# Altium schematic sheet Motor_Driver.SchDoc
size A; SheetNumber: 10; SheetTotal: 11
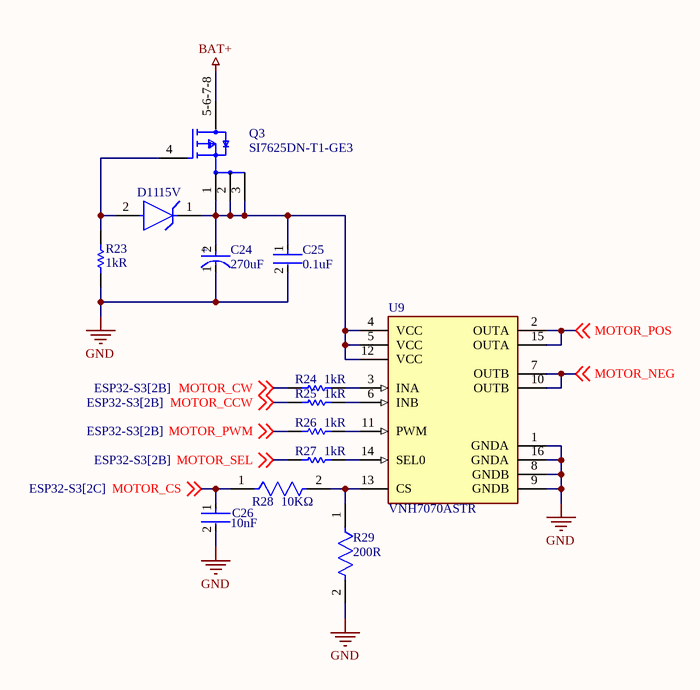
[diagram p0: Motor_Driver.SchDoc]

## Parts
C24  Capacitance: 270uF  [FP-EEH-G-V-MFG]  (hidden comment: EEHZA1V271V)
C25  Capacitance: 0.1uF  [FP-GCD21B-0_15-IPC_B]  (hidden comment: GCD21BR71H104MA01L)
C26  Capacitance: 10nF  [FP-C0805C103K8RACAUTO-MFG]  (hidden comment: C0805C103K8RACAUTO)
D11  Nom Zener Voltage: 15V  [FP-SOD123-MFG]  (hidden comment: MMSZ5245B-7-F)
Q3  SI7625DN-T1-GE3  [FP-S16-2667-SINGLE-MFG]
R23  Resistance: 1kR  [RESC2013X60X35LL10T20]  (hidden comment: AC0805JR-071KL)
R24  Resistance: 1kR  [RESC2013X60X35LL10T20]  (hidden comment: AC0805JR-071KL)
R25  Resistance: 1kR  [RESC2013X60X35LL10T20]  (hidden comment: AC0805JR-071KL)
R26  Resistance: 1kR  [RESC2013X60X35LL10T20]  (hidden comment: AC0805JR-071KL)
R27  Resistance: 1kR  [RESC2013X60X35LL10T20]  (hidden comment: AC0805JR-071KL)
R28  Resistance: 10KΩ  [FP-SR0805-MFG]  (hidden comment: SR0805FR-4710KL)
R29  Resistance: 200R  [FP-CRCW0805-HPe3-IPC_B]  (hidden comment: CRCW0805200RFKEAHP)
U9  VNH7070ASTR  [FP-SO-16N-GAPGCFT00818-MFG]

## Nets
BAT+: Q3.5-6-7-8(D)
GND: C24.1(C) C25.2 C26.2 R23.1 R29.2 U9.1(GNDA) U9.8(GNDB) U9.9(GNDB) U9.16(GNDA)
MOTOR_CCW: R25.1 ; off-sheet MOTOR_CCW
MOTOR_CS: C26.1 R28.1 ; off-sheet MOTOR_CS
MOTOR_CW: R24.1 ; off-sheet MOTOR_CW
MOTOR_NEG: U9.7(OUTB) U9.10(OUTB) ; off-sheet MOTOR_NEG
MOTOR_POS: U9.2(OUTA) U9.15(OUTA) ; off-sheet MOTOR_POS
MOTOR_PWM: R26.1 ; off-sheet MOTOR_PWM
MOTOR_SEL: R27.1 ; off-sheet MOTOR_SEL
NetC24_2: C24.2(A) C25.1 D11.1(C) Q3.1(S) Q3.2(S) Q3.3(S) U9.4(VCC) U9.5(VCC) U9.12(VCC)
NetD11_2: D11.2(A) Q3.4(G) R23.2
NetR24_2: R24.2 U9.3(INA)
NetR25_2: R25.2 U9.6(INB)
NetR26_2: R26.2 U9.11(PWM)
NetR27_2: R27.2 U9.14(SEL0)
NetR28_2: R28.2 R29.1 U9.13(CS)

## Notes on the sheet
- (in symbol CMP-05428-000576-1) +

## Library data of the parts
C24 = CMP-05428-000576-1: Aluminum Hybrid Polymer Capacitors 270uF 20% 35V Life 10000Hours AEC-Q200 RADIAL SMT; ESR (Equivalent Series Resistance): 20mR; Series: ZA; Ratings: AEC-Q200; Resistor Type: Hybrid; Tolerance: 20%; RoHS Compliant: Yes; Max Operating Temperature: 105°C; Min Operating Temperature: -55°C; Packaging: Cut Tape; Life (Hours): 10000Hour; Voltage Rating: 35V; Mount: Surface Mount; Case/Package: Radial
C25 = CMP-06035-004518-1: Chip Multilayer Ceramic Capacitors for Automotive, 0805, 0.10uF, X7R, 15%, 20%, 50V, Grade 1
C26 = CMP-00212-126448506-1: C0805C103K8RACAUTO Cap, 0.01UF, 10V, Mlcc, 0805 Rohs Compliant: Yes; Material: Ceramic; Dielectric: X7R; Tolerance: 10%; Height: 880µm; NexarPartId: 126448506; Voltage Rating: 10V; Voltage Rating (DC): 10V; Min Operating Temperature: -55°C; Max Operating Temperature: 125°C; Case/Package: 0805; RoHS: Compliant
D11 = CMP-12792-000001-1: DIODE ZENER 15V 500MW SOD123; Manufacturer: Diodes Inc.; Power Dissipation: 370mW; Max Zener Voltage: 15.75V; Max Junction Temp: +150°C; Zener Impedance: 16Ω; Standoff Height: 0mm; Reverse Voltage: 11V; Max Reverse Leakage Current: 0.1uA; Device Class L3: Zener Diodes; Device Class L2: Diodes; Automotive: No; Device Class L1: Discrete Semiconductors; ComponentLink2URL: https://www.diodes.com/assets/Datasheets/ds18010.pdf; Package: SOD123; ComponentLink2Description: Datasheet; Digikey Description: DIODE ZENER 15V 500MW SOD123; RoHS: TRUE; Temperature: -65°C to +150°C; Octopart: https://octopart.com/mmsz5245b-7-f-diodes+inc.-332054; Mouser Description: Zener Diodes 15V 500mW; Height: 1.45mm; Temperature Range Low: -65°C; Lead Free: Yes; Manufacturer Part Number: MMSZ5245B-7-F; Footprint Url: https://www.diodes.com/assets/Package-Files/SOD123.pdf; Category: Diode; Temperature Range High: +150°C
Q3 = CMP-00030-44451668-1: SI7625DN-T1-GE3 P-Channel 30 V 7 mO 5126 nC Surface Mount Power Mosfet - PowerPAK-1212-8; Number of Channels: 1; Max Power Dissipation: 52W; Drain to Source Resistance: 7mΩ; Threshold Voltage: -1V; Power Dissipation: 3.7W; Input Capacitance: 4.427nF; Element Configuration: Single; Gate to Source Voltage (Vgs): 20V; Drain to Source Voltage (Vdss): -30V; Continuous Drain Current (ID): 17.3A; Lead Free: Lead Free; Number of Pins: 8; Min Operating Temperature: -55°C; NexarPartId: 44451668; Schedule B: 8541290080, 8541290080; Radiation Hardening: No; Rds On Max: 7mΩ; Number of Elements: 1; Max Operating Temperature: 150°C; Mount: Surface Mount; Resistance: 7MΩ; Packaging: Digi-Reel®; REACH SVHC: No SVHC; RoHS: Compliant
R23-R27 = CMP-2001-04511-1: Manufacturer: Yageo; Part Number: AC0805JR-071KL
R28 = CMP-03412-005404-1: RES SMD 0805 1/2W 1% 10K OHM; Manufacturer: Yageo; Value: 10KΩ; Power Rating: 0.5W; Voltage Rating: 150V; Tolerance: 0.01; Automotive Grade: Grade 0; RoHS: TRUE; Package: SR0805; Temperature: -55°C to +155°C; Composition: Thick Film; Lead Free: Yes; Ipc Land Pattern Name: RESC200125X50; Footprint Url: http://www.yageo.com/exep/pages/download/literatures/PYu-R_Mount_10.pdf; ComponentLink2URL: http://www.yageo.com/documents/recent/PYu-SR_D_F%20tol_RoHS_L_3.pdf; Series: SR; Device Class L3: Chip SMD Resistors; Manufacturer Part Number: SR0805FR-4710KL; Device Class L2: Resistors; Digikey Description: RES SMD 0805 1/2W 1% 10K OHM; Category: Res; Temperature Range Low: -55°C; ComponentLink2Description: Datasheet; Automotive: Yes; Height: 0.6mm; Octopart: https://octopart.com/sr0805fr-4710kl-yageo-91478094; Device Class L1: Passive Components; Temperature Range High: +155°C
R29 = CMP-02407-008327-1: RES Thick Film, 200Ω, 1%, 0.5W, 100ppm/°C, 0805; Max Power Dissipation: 500mW; Min Operating Temperature: -55°C; Composition: Thick Film; Depth: 1.25mm; Max Operating Temperature: 155°C; Case/Package: 0805; Height: 0.024inch; Length: 2mm; Package Quantity: 5000; Military Standard: Not; Mount: Surface Mount; Contact Plating: Tin; Width: 0.049inch; Radiation Hardening: No; Packaging: Tape and Reel; Features: Automotive AEC-Q200; Number of Terminations: 2; Tolerance: 1%; Temperature Coefficient: 100ppm/°C; Lead Free: Lead Free
U9 = CMP-2000-07519-2: IC MOTOR DRIVER 4V-28V 16SOIC; Manufacturer: STMicroelectronics; Standoff Height: 0.1mm; Number Of Outputs: 2; Max Junction Temp: +150°C; Output Current: 15A; Max Supply Voltage: 28V; Automotive Grade: Grade 0; Motor Type: Brushed; Min Supply Voltage: 4V; Nominal Supply Current: 2-3.5mA; Digikey Description: IC MOTOR DRIVER 4V-28V 16SOIC; Device Class L1: Integrated Circuits (ICs); Ipc Land Pattern Name: SOIC127P600X175-16; Device Class L2: Power Management ICs; ComponentLink2Description: Datasheet; ComponentLink2URL: https://www.st.com/resource/en/datasheet/vnh7070as.pdf; Height: 1.75mm; RoHS: TRUE; Manufacturer Part Number: VNH7070ASTR; Octopart: https://octopart.com/vnh7070astr-stmicroelectronics-66668687; Temperature Range Low: -40°C; Mouser Description: STMicroelectronics VNH7070ASTR Motor Driver IC 16-Pin, SOIC; Device Class L3: Motor Drivers; Lead Free: Yes; Temperature: -40°C to +150°C; Automotive: Yes; Package: SO-16N-GAPGCFT00818; Temperature Range High: +150°C; Category: IC; Footprint Url: https://www.st.com/resource/en/datasheet/l6566a.pdf